# EAGLE design smiw-proj (EAGLE 9.2.2)
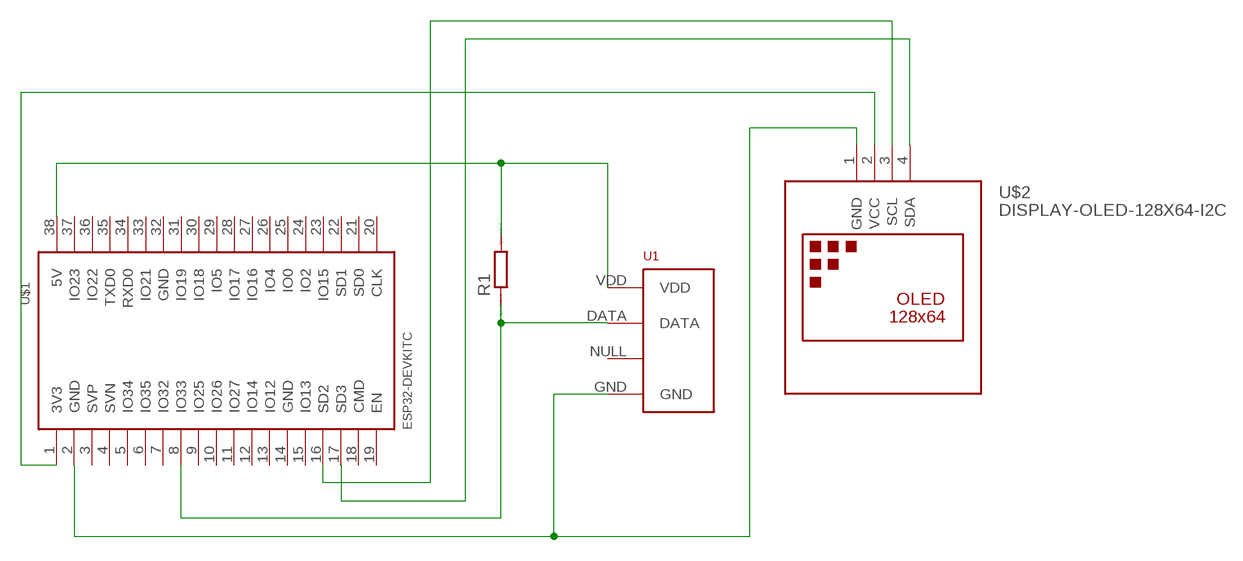
[diagram p0: schematic, sheet 1]

## Parts
R1  R0204/7  [0204/7]
U1  RHT03_DHT-22_AM2302RA  [RHT03_DHT-22/RA]
U$1  ESP32DEVKITC  [ESP32-DEVKITC]
U$2  DISPLAY-OLED-128X64-I2C  [DISPLAY-OLED-128X64-I2C]

## Nets
N$1: R1.1 U1.DATA U$1.8(IO33)
N$2: R1.2 U1.VDD U$1.38(5V)
N$3: U$1.1(3V3) U$2.2(VCC)
N$5: U1.GND U$1.2(GND) U$2.1(GND)
N$6: U$1.17(SD3) U$2.4(SDA)
N$7: U$1.16(SD2) U$2.3(SCL)
Unconnected: U1.NULL U$1.3(SVP) U$1.4(SVN) U$1.5(IO34) U$1.6(IO35) U$1.7(IO32) U$1.9(IO25) U$1.10(IO26) U$1.11(IO27) U$1.12(IO14) U$1.13(IO12) U$1.14(GND) U$1.15(IO13) U$1.18(CMD) U$1.19(EN) U$1.20(CLK) U$1.21(SD0) U$1.22(SD1) U$1.23(IO15) U$1.24(IO2) U$1.25(IO0) U$1.26(IO4) U$1.27(IO16) U$1.28(IO17) U$1.29(IO5) U$1.30(IO18) U$1.31(IO19) U$1.32(GND) U$1.33(IO21) U$1.34(RXD0) U$1.35(TXD0) U$1.36(IO22) U$1.37(IO23)

## Library data of the parts
R1 = eagle-ltspice:R: RESISTOR, European symbol; SPICEMODEL: NONE; SPICEPREFIX: R
U1 = am3202:RHT03_DHT-22_AM2302: RHT03 / DHT-22 / AM2302 Packages and symbol for the RHT03 / DHT-22 relative humidity and temperature sensor. Note: The AM2302 is a wired version of the DHT-22 which typically requires less clearance and is thus provided as a separate package.; PROD_ID: SEN-10167
U$1 = ESP32DEVKITC:ESP32DEVKITC; AVAILABILITY: Unavailable; DESCRIPTION: Module: development kit; Ciphering: AES, WPA, WPA2-PSK, WPS; MF: Espressif Systems; MP: ESP32-DEVKITC; PACKAGE: None; PRICE: None
U$2 = oled09:DISPLAY-OLED-128X64-I2C: 128x64 Dot Matrix OLED Module based on SSD1306 chip Variant with I2C interface More details available here: http://www.instructables.com/id/Monochrome-096-i2c-OLED-display-with-arduino-SSD13/ SSD1306 datasheet: https://cdn-shop.adafruit.com/datasheets/SSD1306.pdf Click here to find device on ebay.com <http://www.ebay.com/sch/oled+display+128x64+iic> Note: There are two variants: I2C and SPI. Search for the proper version.

## Board
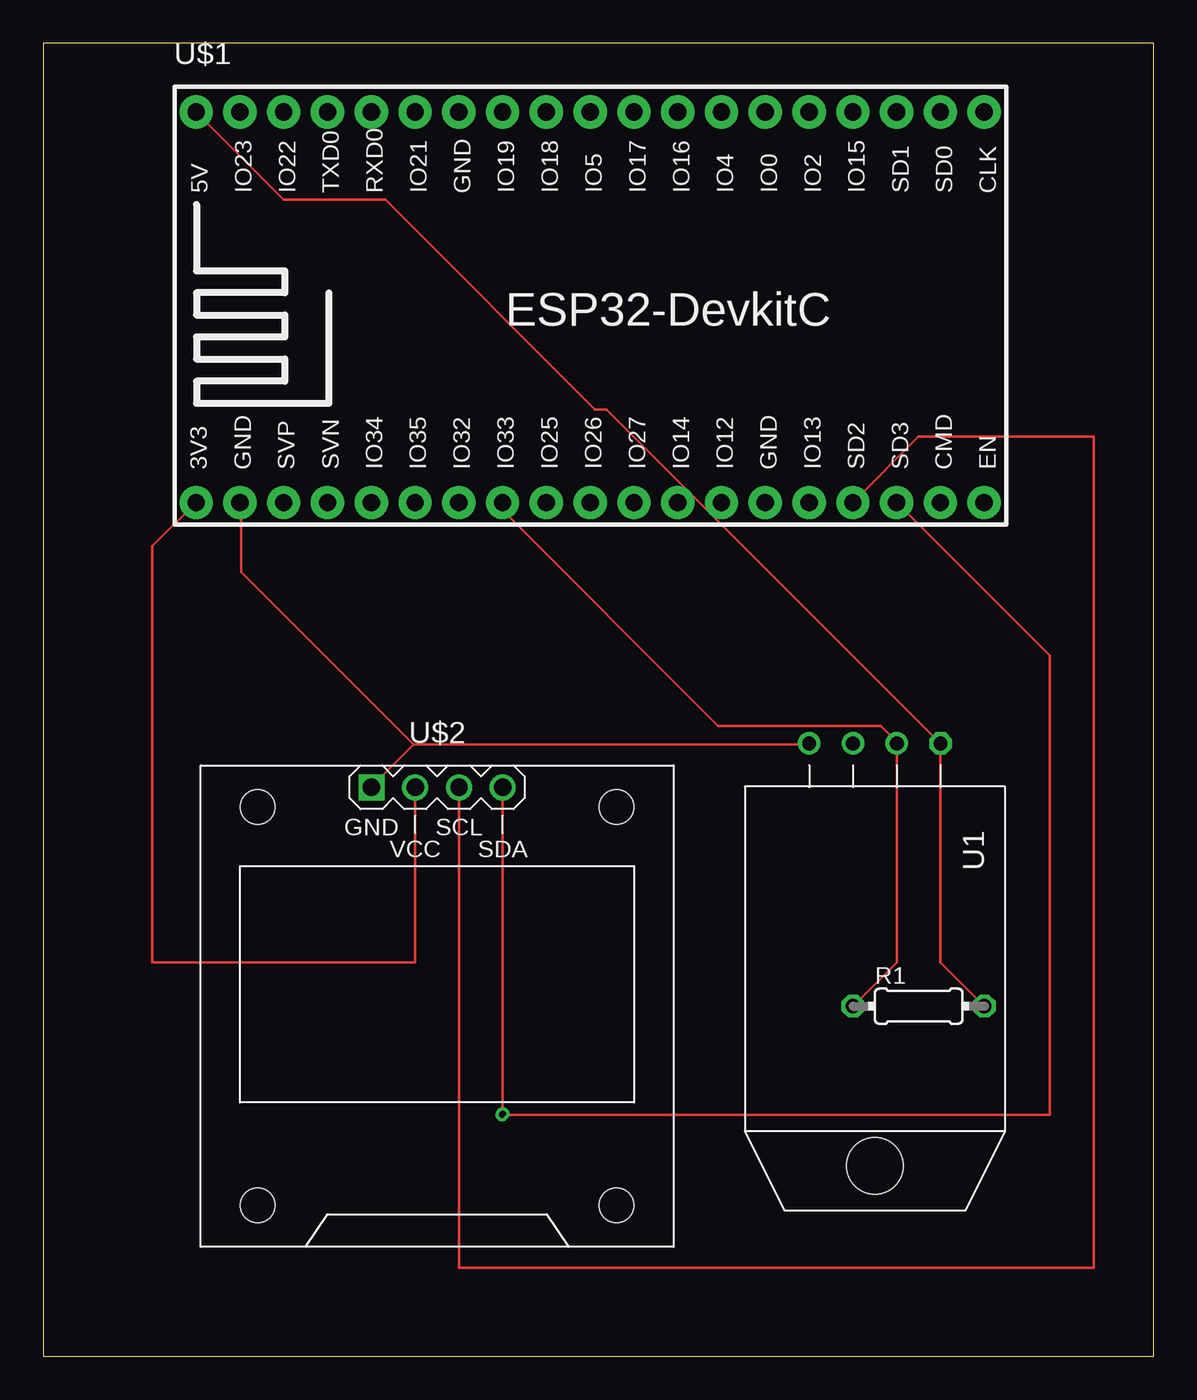
[diagram p1: board, top side]
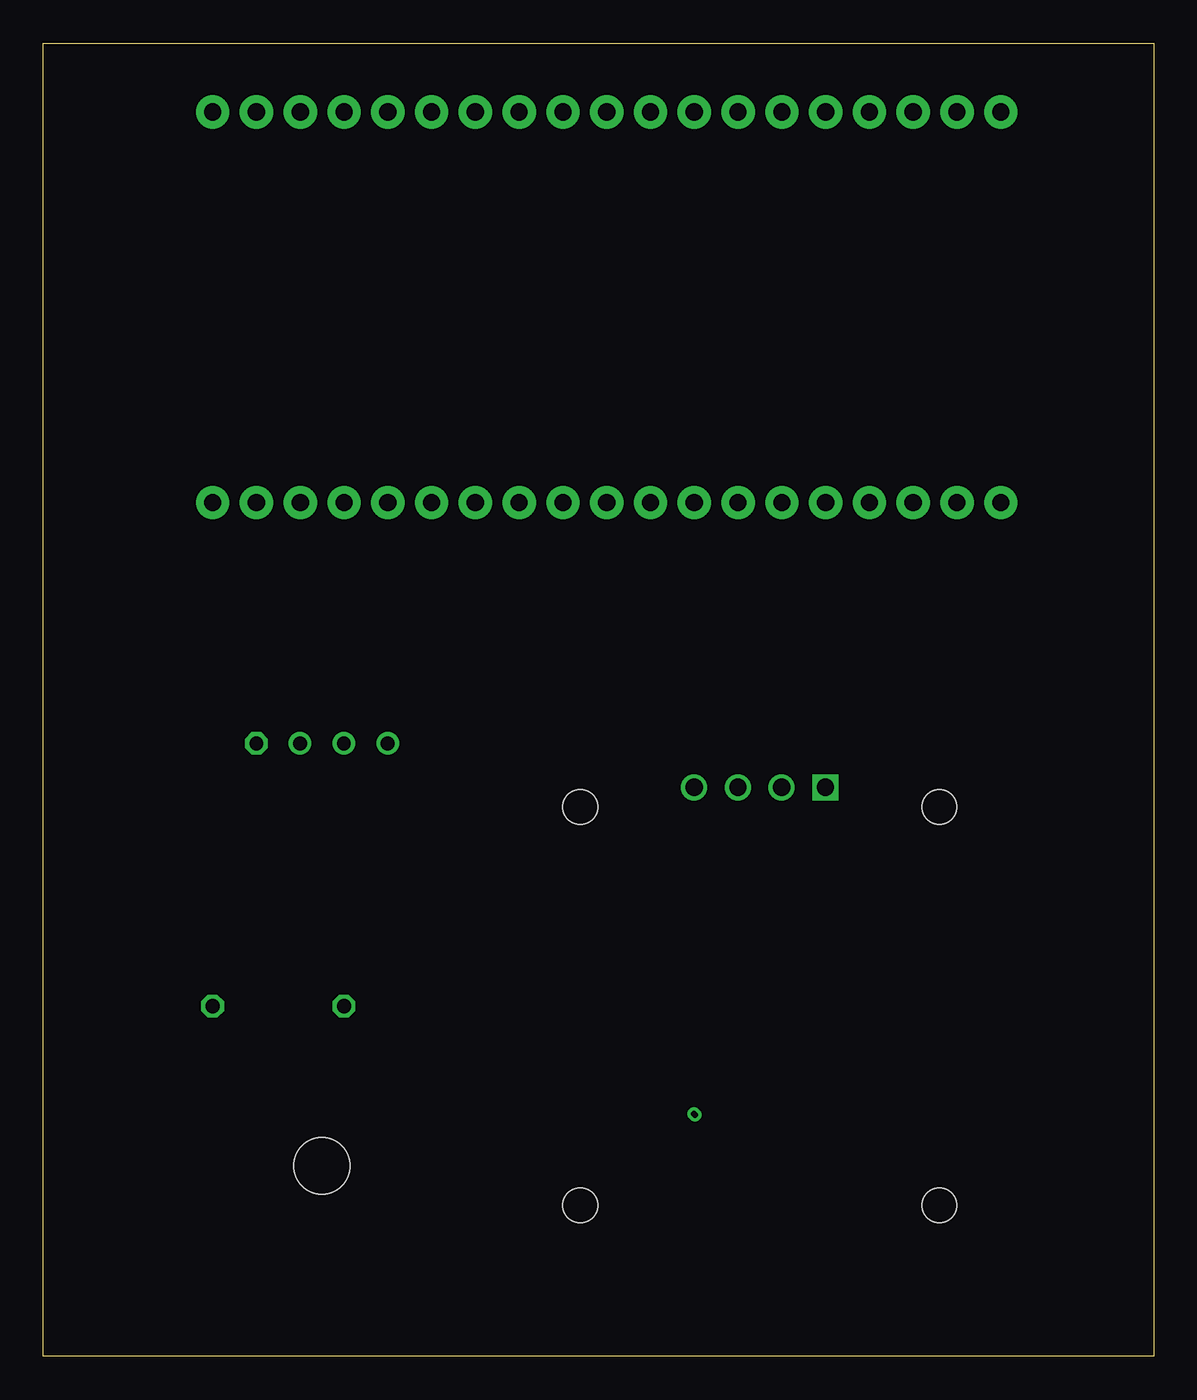
[diagram p2: board, bottom side, seen from below]

Size 64.44 x 76.19 mm. Coordinates in mm from the lower left corner, seen from the top.
Outline: 0,0 64.44,0 64.44,76.19 0,76.19 0,0
Copper layers (1*16): Top 0.035mm / dielectric 1.5mm / Bottom 0.035mm
Design rules "default": minimum track width 6mil, minimum drill 0.35mm, track to track 6mil, track to pad 6mil, pad to pad 6mil, via to via 6mil, smd to smd 6mil, copper to edge 40mil, drill to drill 6mil, minimum pad ring 10mil, minimum via ring 8mil, stop-mask expansion 4mil, vias tented up to drill 0mil, thermal gap 10mil

### Footprints (pad centres in the part's own frame; a part is rotated, then mirrored left to right if it is on the bottom)
0204/7 = drill 0.813 octagon: 1 -3.81,0; 2 3.81,0
RHT03_DHT-22/RA = drill 0.8: DATA -1.27,0; GND 3.81,0; NULL 1.27,0 | drill 0.8 octagon: VDD -3.81,0 | hole 3.25: 0,24.5
ESP32-DEVKITC = drill 1 pad 1.93: 1 -22.87,-11.42; 2 -20.33,-11.42; 3 -17.79,-11.42; 4 -15.25,-11.42; 5 -12.71,-11.42; 6 -10.17,-11.42; 7 -7.63,-11.42; 8 -5.09,-11.42; 9 -2.55,-11.42; 10 -0.01,-11.42; 11 2.53,-11.42; 12 5.07,-11.42; 13 7.61,-11.42; 14 10.15,-11.42; 15 12.69,-11.42; 16 15.23,-11.42; 17 17.77,-11.42; 18 20.31,-11.42; 19 22.85,-11.42; 20 22.85,11.23; 21 20.31,11.23; 22 17.77,11.23; 23 15.23,11.23; 24 12.69,11.23; 25 10.15,11.23; 26 7.61,11.23; 27 5.07,11.23; 28 2.53,11.23; 29 -0.01,11.23; 30 -2.55,11.23; 31 -5.09,11.23; 32 -7.63,11.23; 33 -10.17,11.23; 34 -12.71,11.23; 35 -15.25,11.23; 36 -17.79,11.23; 37 -20.33,11.23; 38 -22.87,11.23
DISPLAY-OLED-128X64-I2C = drill 1 square: 1 -3.81,12.7 | drill 1: 2 -1.27,12.7; 3 1.27,12.7; 4 3.81,12.7 | hole 2: -10.414,11.557; 10.414,11.557; 10.414,-11.557; -10.414,-11.557

### Placement (x,y rotation side)
R1  50.8,20.32 0 top
U1  48.26,35.56 180 top
U$1  31.75,60.96 0 top
U$2  22.86,20.32 0 top

### Tracks (layer width: path | path; a pad name or v marks a point on that pad's centre or on a via)
N$1
  Top 0.152: R1.1 49.53,22.86 U1.DATA 49.53,35.66 48.62,36.58 39.17,36.58 26.35,49.39 U$1.8
N$2
  Top 0.152: R1.2 52.07,22.86 U1.VDD 32.69,54.94 32.03,54.94 19.86,67.11 13.96,67.11 U$1.38
N$3
  Top 0.152: U$1.1 6.34,47 6.34,22.86 21.59,22.86 U$2.2
N$5
  Top 0.152: 21.49,35.51 44.35,35.51 U1.GND | 21.49,35.51 19.05,33.07 U$2.1 | U$1.2 11.48,49.48 11.48,45.52 21.49,35.51
N$6  (via drill 0.35)
  Top 0.152: v26.62,14.02 58.41,14.02 58.41,40.65 U$1.17 | U$2.4 v26.67,14.07
  Bottom 0.152: v26.67,14.07 v26.62,14.02
N$7
  Top 0.152: U$2.3 24.13,5.13 60.95,5.13 60.95,53.35 50.79,53.35 U$1.16